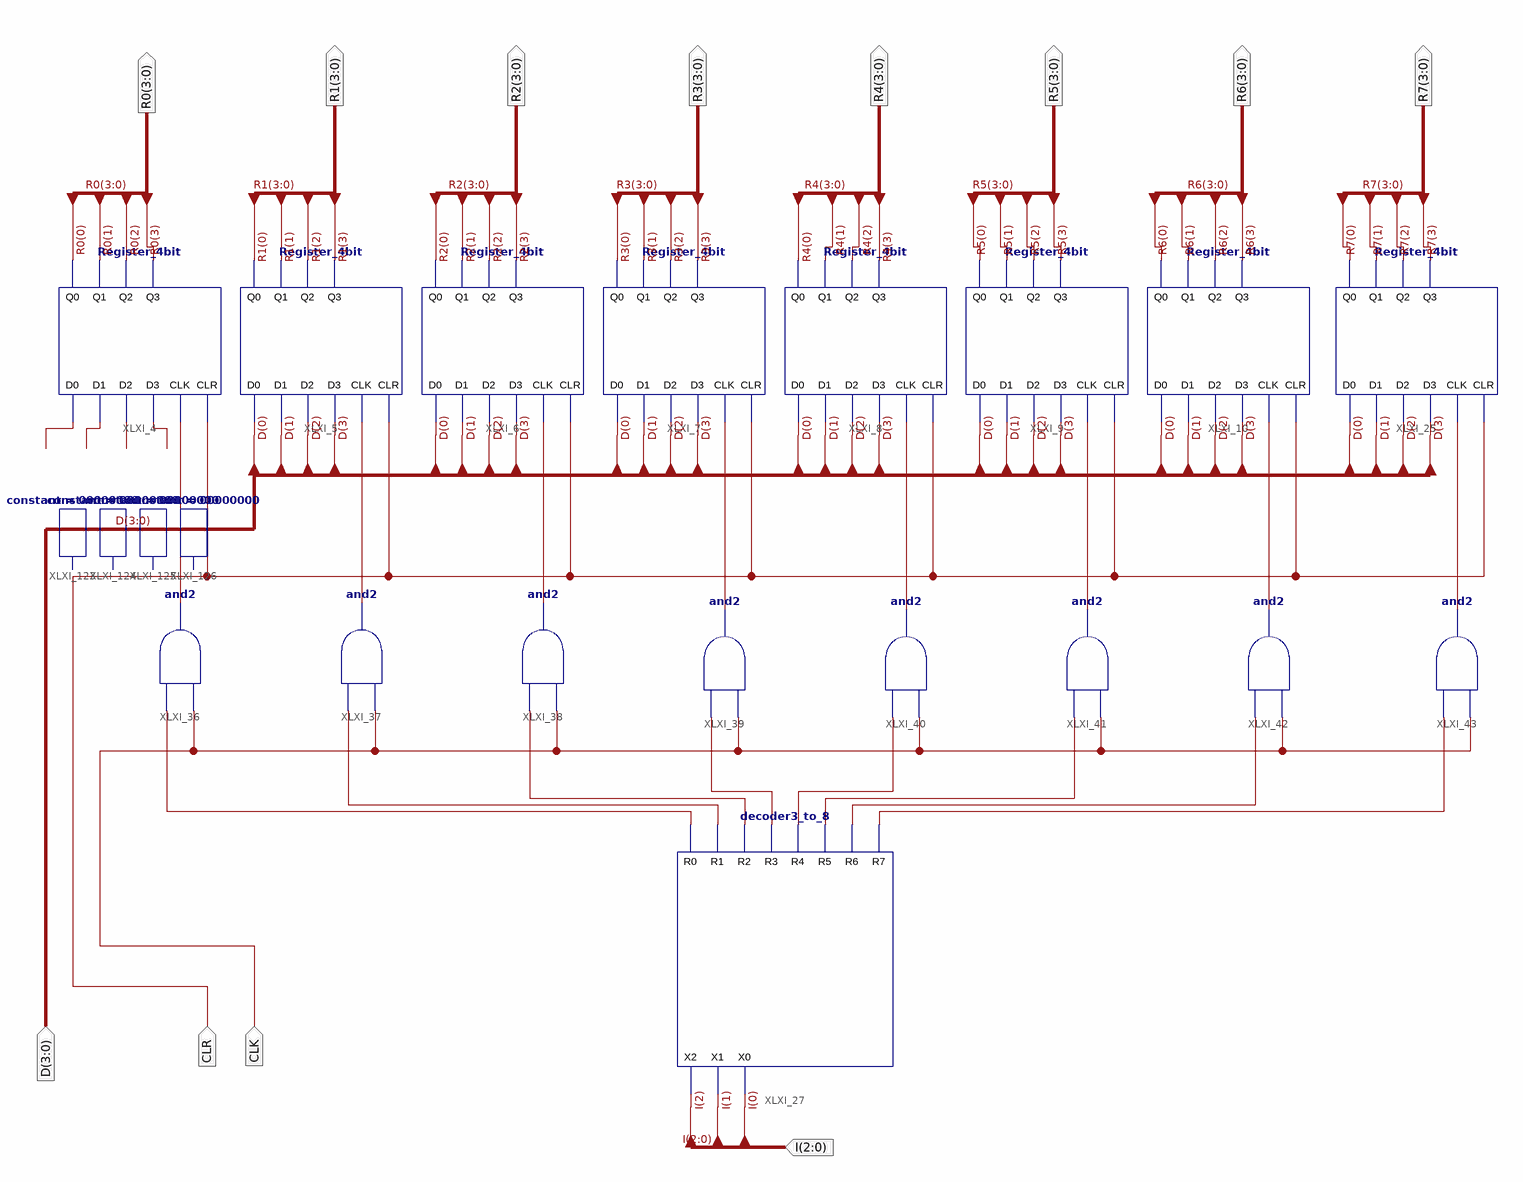
[diagram p0: schematic sheet 1]
// Xilinx ISE schematic Register_Bank.sch (spartan3e) as structural Verilog: 21 symbols, 12 ports
module Register_Bank (
  input  CLR,
  input  [3:0] D,
  input  CLK,
  input  [2:0] I,
  output [3:0] R0,
  output [3:0] R1,
  output [3:0] R3,
  output [3:0] R4,
  output [3:0] R6,
  output [3:0] R7,
  output [3:0] R2,
  output [3:0] R5
);

  wire XLXN_7, XLXN_8, XLXN_9, XLXN_10, XLXN_11, XLXN_12, XLXN_13, XLXN_14, XLXN_17, XLXN_18, XLXN_19,
       XLXN_20, XLXN_21, XLXN_22, XLXN_23, XLXN_24, XLXN_219, XLXN_220, XLXN_221, XLXN_222;

  Register_4bit XLXI_5 (
    .D3(D[3]), .D2(D[2]), .D1(D[1]), .D0(D[0]), .CLK(XLXN_8), .CLR(CLR), .Q3(R1[3]), .Q2(R1[2]), .Q1(R1[1]),
    .Q0(R1[0]));
  Register_4bit XLXI_6 (
    .D3(D[3]), .D2(D[2]), .D1(D[1]), .D0(D[0]), .CLK(XLXN_9), .CLR(CLR), .Q3(R2[3]), .Q2(R2[2]), .Q1(R2[1]),
    .Q0(R2[0]));
  Register_4bit XLXI_10 (
    .D3(D[3]), .D2(D[2]), .D1(D[1]), .D0(D[0]), .CLK(XLXN_13), .CLR(CLR), .Q3(R6[3]), .Q2(R6[2]), .Q1(R6[1]),
    .Q0(R6[0]));
  Register_4bit XLXI_9 (
    .D3(D[3]), .D2(D[2]), .D1(D[1]), .D0(D[0]), .CLK(XLXN_12), .CLR(CLR), .Q3(R5[3]), .Q2(R5[2]), .Q1(R5[1]),
    .Q0(R5[0]));
  Register_4bit XLXI_8 (
    .D3(D[3]), .D2(D[2]), .D1(D[1]), .D0(D[0]), .CLK(XLXN_11), .CLR(CLR), .Q3(R4[3]), .Q2(R4[2]), .Q1(R4[1]),
    .Q0(R4[0]));
  Register_4bit XLXI_7 (
    .D3(D[3]), .D2(D[2]), .D1(D[1]), .D0(D[0]), .CLK(XLXN_10), .CLR(CLR), .Q3(R3[3]), .Q2(R3[2]), .Q1(R3[1]),
    .Q0(R3[0]));
  Register_4bit XLXI_25 (
    .D3(D[3]), .D2(D[2]), .D1(D[1]), .D0(D[0]), .CLK(XLXN_14), .CLR(CLR), .Q3(R7[3]), .Q2(R7[2]), .Q1(R7[1]),
    .Q0(R7[0]));
  decoder3_to_8 XLXI_27 (
    .X1(I[1]), .X0(I[0]), .X2(I[2]), .R0(XLXN_17), .R1(XLXN_18), .R2(XLXN_19), .R3(XLXN_20), .R4(XLXN_21),
    .R5(XLXN_22), .R6(XLXN_23), .R7(XLXN_24));
  and XLXI_36 (XLXN_7, CLK, XLXN_17);
  and XLXI_37 (XLXN_8, CLK, XLXN_18);
  and XLXI_38 (XLXN_9, CLK, XLXN_19);
  and XLXI_39 (XLXN_10, CLK, XLXN_20);
  and XLXI_40 (XLXN_11, CLK, XLXN_21);
  and XLXI_41 (XLXN_12, CLK, XLXN_22);
  and XLXI_42 (XLXN_13, CLK, XLXN_23);
  and XLXI_43 (XLXN_14, CLK, XLXN_24);
  Register_4bit XLXI_4 (
    .D3(XLXN_222), .D2(XLXN_221), .D1(XLXN_220), .D0(XLXN_219), .CLK(XLXN_7), .CLR(CLR), .Q3(R0[3]),
    .Q2(R0[2]), .Q1(R0[1]), .Q0(R0[0]));
  constant #(.CValue("00000000")) XLXI_123 (.O(XLXN_219));
  constant #(.CValue("00000000")) XLXI_124 (.O(XLXN_220));
  constant #(.CValue("00000000")) XLXI_125 (.O(XLXN_221));
  constant #(.CValue("00000000")) XLXI_126 (.O(XLXN_222));
endmodule
